# Altium schematic sheet W25Qxx-SpiFlash.SchDoc
size A; SheetNumber: 3; SheetTotal: 12
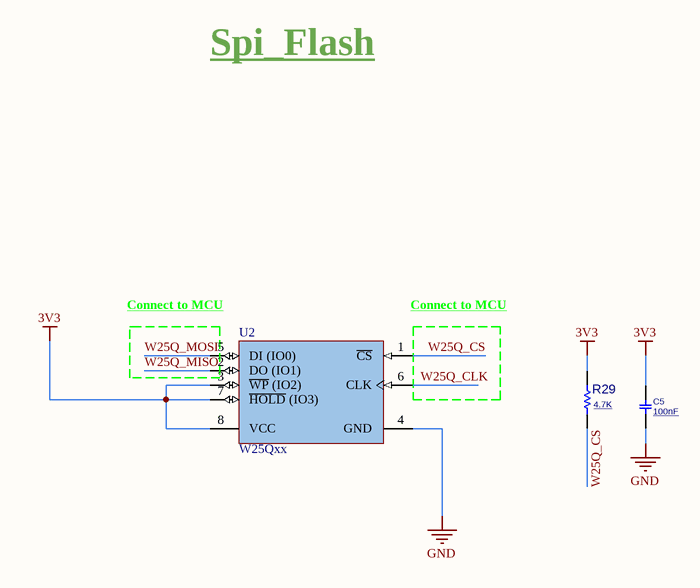
[diagram p0: W25Qxx-SpiFlash.SchDoc]

## Parts
C5  100nF  [C0603]
R29  4.7K  [R0603]
U2  W25Qxx  [WINB-SOIC-8_M]

## Nets
3V3: C5.2 R29.2 U2.3(~{WP}_(IO2)) U2.7(~{HOLD}_(IO3)) U2.8(VCC)
GND: C5.1 U2.4(GND)
W25Q_CLK: U2.6(CLK)
W25Q_CS: R29.1 U2.1(~{CS})
W25Q_MISO: U2.2(DO_(IO1))
W25Q_MOSI: U2.5(DI_(IO0))

## Notes on the sheet
- Spi_Flash
- (near U2) Connect to MCU

## Library data of the parts
C5 = CAP_SMD_MLCC_0603: CAP, MLCC, -F, -V, MATERIAL, -%, 0201; PARAM: -, -%; MANF_P#: MANF_PART#; PRICE: 100= 1$; MANF: -; PARAM2: -V; ASSEMBLY: ASSEMBLY; VALUE: 100nF
R29 = RES_SMD: RESISTOR, SMD; PARAM: -W; DESC: DESCRIPTION; DIST#: MOUSER; PARAM2: 1%; MANF_P#: -; MANF: -; ASSEMBLY: ASSEMBLY; PRICE: 100= 0.5$; VALUE: 4.7K
U2 = W25Qxx: Manufacturer: Winbond; Boot Type: Bottom/Top; Word Size: 8b; Cell Type: NOR; Operating Supply Voltage (Min): 2.7V; Operating Supply Voltage (Max): 3.6V; Rad Hardened: No; Density: 67108864Bit; Address Bus: 1b; Supply Current: 40mA; Program/Erase Volt (Typ): 2.7to3.6V; Sync/Async: Synchronous; Number of Words: 8M; Programmable: Yes; Operating Supply Voltage (Typ): 3/3.3V; Access Time (Max): 8.5ns; Interface Type: Serial(SPI); Operating Temperature Classification: Industrial; Datasheet Version: Rev. D, 12/2011; Operating Temp Range: -40Cto85C; Operating Temperature (Max): 85C; Pin Count: 8; Mounting: SurfaceMount; Operating Temperature (Min): -40C; Package Description: 8-Pin Small Outline Integrated Circuit, Body 5.28 x 5.28 mm, Pitch 1.27 mm; Datasheet URL: https://datasheet.ciiva.com/15126/getdatasheetpartid-552937-15126648.pdf; Package Reference: SS-8; Manufacturer URL: http://www.winbond.com/hq/index.html?__locale=en; Package Type: SOIC